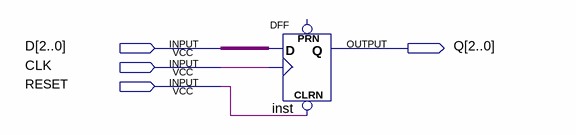
[diagram p0: schematic sheet]
// Quartus schematic CURRENT_STATE.bdf as structural Verilog: 1 symbols, 4 pins
module CURRENT_STATE (
  input  [2:0] D,
  input  CLK,
  input  RESET,
  output [2:0] Q
);

  DFF inst[2:0] (.CLRN(RESET), .CLK(CLK), .D(D), .Q(Q));  // open: PRN
endmodule
